# EAGLE board Maker Display2 (EAGLE 7.3.0), part 1 of 2
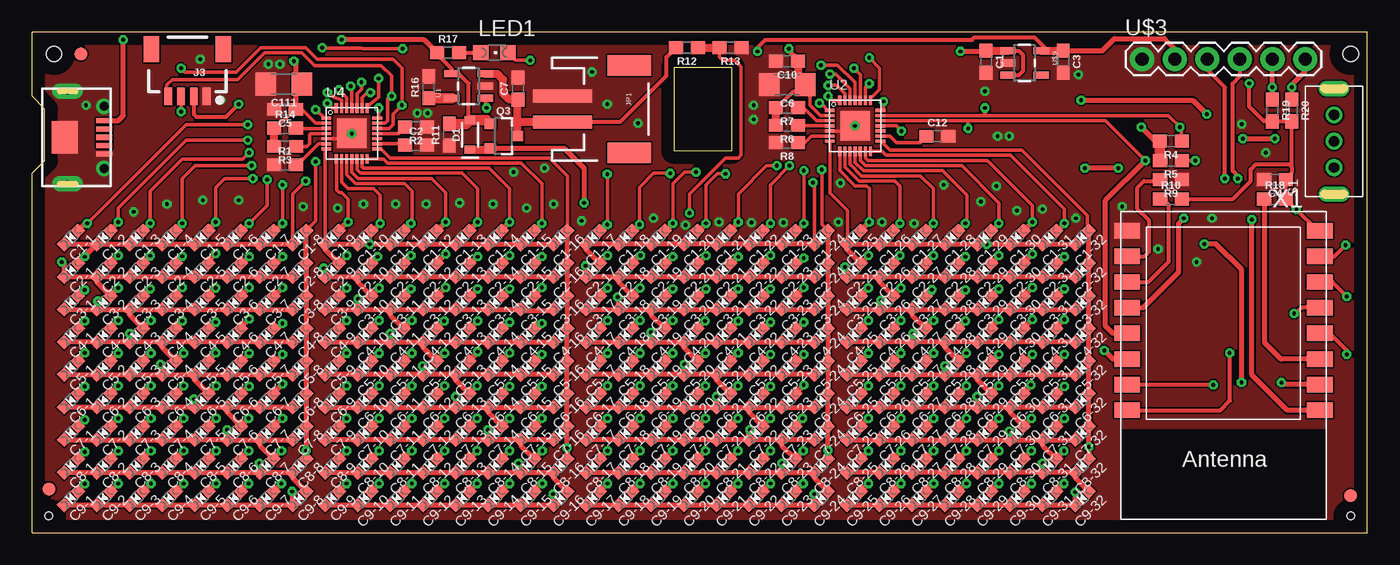
[diagram p5: board, top side]
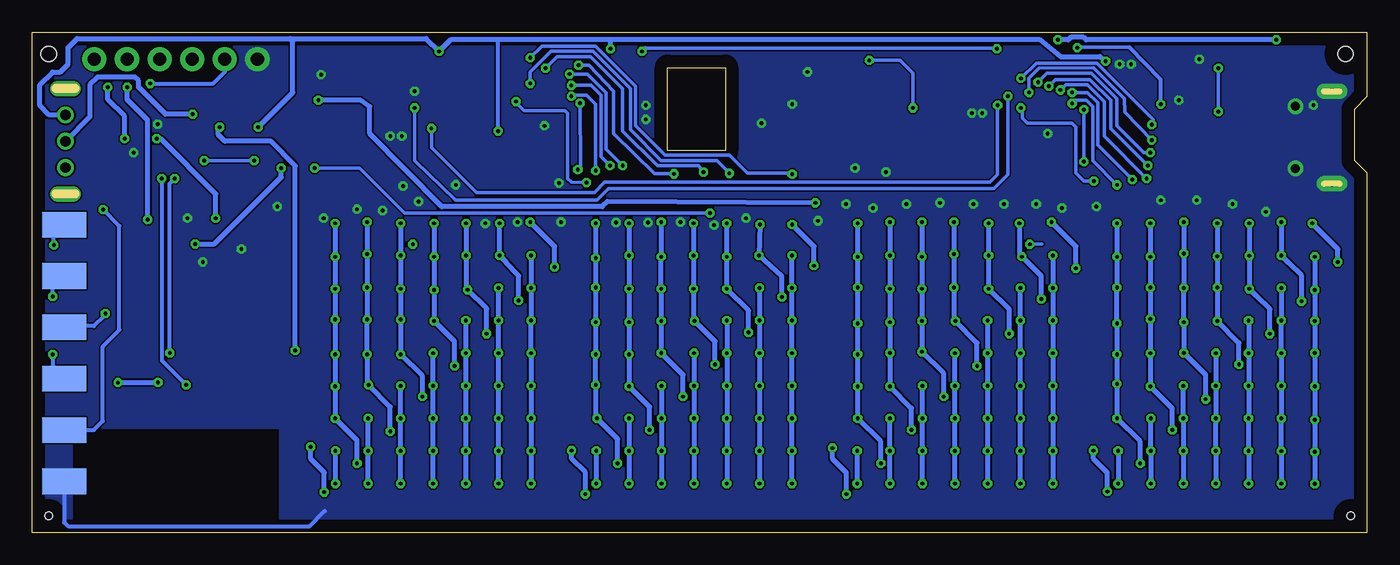
[diagram p6: board, bottom side, seen from below]

Size 104 x 39 mm. Coordinates in mm from the lower left corner, seen from the top.
Outline: 0,0 104,0 104,39 0,39 0,34 1,33 1,29 0,28 0,0
Outline: 50,36.25 50,29.75 54.5,29.75 54.5,36.25 50,36.25
Copper layers (1*16): Top 0.035mm / dielectric 1.5mm / Bottom 0.035mm
Design rules "default *": minimum track width 0.15mm, minimum drill 0.29mm, track to track 5mil, track to pad 5mil, pad to pad 5mil, via to via 5mil, smd to smd 0mil, copper to edge 40mil, drill to drill 8mil, minimum pad ring 10mil, minimum via ring 8mil, stop-mask expansion 4mil, vias tented up to drill 0.5mm, thermal gap 10mil
Holes 0.6 mm at 1.3,1.3 102.7,1.3
Holes 1.2 mm at 1.7,37.3 102.7,37.3

## Footprints (pad centres in the part's own frame; a part is rotated, then mirrored left to right if it is on the bottom)
0603 = smd 1.1 x 1: 1 -0.85,0; 2 0.85,0
CHIPLED_0603_NOOUTLINE = smd 0.8 x 0.8: A 0,-0.75; C 0,0.75
1206 = smd 1.6 x 1.8: 1 -1.4,0; 2 1.4,0
SOD-323 = smd 0.63 x 0.83: A 1.15,0; C -1.15,0
1X04_1MM_RA = smd 0.6 x 1.35: 1 -1.5,0; 2 -0.5,0; 3 0.5,0; 4 1.5,0 | smd 1.2 x 2: NC1 2.8,-3.675; NC2 -2.8,-3.675
JST-2-SMD = smd 1 x 4.6: 1 -1,-3.7; 2 1,-3.7 | smd 1.6 x 3.4: NC1 -3.4,1.5; NC2 3.4,1.5
FIDUCIAL-1X2 = smd 1 x 1: 1 0,0
CHIPLED_0805 = smd 1.2 x 1.2: A 0,-1.05; C 0,1.05
SOT23-3 = smd 0.8 x 0.9: 1 -0.95,-1; 2 0.95,-1; 3 0,1.1
SK-12D02-VG5 = drill 0.8: 1 -2.05,0; 2 0,0; 3 2.05,0 | drill 0.5 pad 1.2 long: P$2 -4.1,0; P$5 4.1,0
SOT23-5 = smd 0.55 x 1.2: 1 -0.95,-1.3; 2 0,-1.3; 3 0.95,-1.3; 4 0.95,1.3; 5 -0.95,1.3
QFN28 = smd 0.75 x 0.25: 1 -1.975,1.2; 2 -1.975,0.8; 3 -1.975,0.4; 4 -1.975,0; 5 -1.975,-0.4; 6 -1.975,-0.8; 7 -1.975,-1.2; 15 1.975,-1.2; 16 1.975,-0.8; 17 1.975,-0.4; 18 1.975,0; 19 1.975,0.4; 20 1.975,0.8; 21 1.975,1.2 | smd 0.25 x 0.75: 8 -1.2,-1.975; 9 -0.8,-1.975; 10 -0.4,-1.975; 11 0,-1.975; 12 0.4,-1.975; 13 0.8,-1.975; 14 1.2,-1.975; 22 1.2,1.975; 23 0.8,1.975; 24 0.4,1.975; 25 0,1.975; 26 -0.4,1.975; 27 -0.8,1.975; 28 -1.2,1.975 | smd 2.3 x 2.3: 29_GND 0,0
ESP-PROGRAMMING-PORT = drill 1.016 pad 1.88: 1 -6.35,0; 2 -3.81,0; 3 -1.27,0; 4 1.27,0; 5 3.81,0; 6 6.35,0
PAD-1 = smd 3.41 x 2: 1 0,0
U-F-M5DD-Y-L = smd 0.4 x 1.25: 1 1.3,0; 2 0.65,0; 3 0,0; 4 -0.655,0; 5 -1.3,0 | smd 2.54 x 2: PAD 0,3.06 | drill 0.7 pad 1.2: SHIELD1 2.425,0; SHIELD2 -2.425,0 | drill 0.5 pad 1.2 long: SHIELD3 -3.6,2.84; SHIELD4 3.6,2.84
ESP-12 = smd 2 x 1.2: 1 -7.5,4.5; 2 -7.5,2.5; 3 -7.5,0.5; 4 -7.5,-1.5; 5 -7.5,-3.5; 6 -7.5,-5.5; 7 -7.5,-7.5; 8 -7.5,-9.5; 9 7.5,-9.5; 10 7.5,-7.5; 11 7.5,-5.5; 12 7.5,-3.5; 13 7.5,-1.5; 14 7.5,0.5; 15 7.5,2.5; 16 7.5,4.5

## Placement (x,y rotation side)
C1  2.2uF  [0603]  74.3,36.7 270 top
C1-1  COLOR  [CHIPLED_0603_NOOUTLINE]  3.03,23 135 top
C1-2  COLOR  [CHIPLED_0603_NOOUTLINE]  5.57,23 135 top
C1-3  COLOR  [CHIPLED_0603_NOOUTLINE]  8.11,23 135 top
C1-4  COLOR  [CHIPLED_0603_NOOUTLINE]  10.65,23 135 top
C1-5  COLOR  [CHIPLED_0603_NOOUTLINE]  13.19,23 135 top
C1-6  COLOR  [CHIPLED_0603_NOOUTLINE]  15.73,23 135 top
C1-7  COLOR  [CHIPLED_0603_NOOUTLINE]  18.27,23 135 top
C1-8  COLOR  [CHIPLED_0603_NOOUTLINE]  20.81,23 135 top
C1-9  COLOR  [CHIPLED_0603_NOOUTLINE]  23.35,23 135 top
C1-10  COLOR  [CHIPLED_0603_NOOUTLINE]  25.89,23 135 top
C1-11  COLOR  [CHIPLED_0603_NOOUTLINE]  28.43,23 135 top
C1-12  COLOR  [CHIPLED_0603_NOOUTLINE]  30.97,23 135 top
C1-13  COLOR  [CHIPLED_0603_NOOUTLINE]  33.51,23 135 top
C1-14  COLOR  [CHIPLED_0603_NOOUTLINE]  36.05,23 135 top
C1-15  COLOR  [CHIPLED_0603_NOOUTLINE]  38.59,23 135 top
C1-16  COLOR  [CHIPLED_0603_NOOUTLINE]  41.13,23 135 top
C1-17  COLOR  [CHIPLED_0603_NOOUTLINE]  43.67,23 135 top
C1-18  COLOR  [CHIPLED_0603_NOOUTLINE]  46.21,23 135 top
C1-19  COLOR  [CHIPLED_0603_NOOUTLINE]  48.75,23 135 top
C1-20  COLOR  [CHIPLED_0603_NOOUTLINE]  51.29,23 135 top
C1-21  COLOR  [CHIPLED_0603_NOOUTLINE]  53.83,23 135 top
C1-22  COLOR  [CHIPLED_0603_NOOUTLINE]  56.37,23 135 top
C1-23  COLOR  [CHIPLED_0603_NOOUTLINE]  58.91,23 135 top
C1-24  COLOR  [CHIPLED_0603_NOOUTLINE]  61.45,23 135 top
C1-25  COLOR  [CHIPLED_0603_NOOUTLINE]  63.99,23 135 top
C1-26  COLOR  [CHIPLED_0603_NOOUTLINE]  66.53,23 135 top
C1-27  COLOR  [CHIPLED_0603_NOOUTLINE]  69.07,23 135 top
C1-28  COLOR  [CHIPLED_0603_NOOUTLINE]  71.61,23 135 top
C1-29  COLOR  [CHIPLED_0603_NOOUTLINE]  74.15,23 135 top
C1-30  COLOR  [CHIPLED_0603_NOOUTLINE]  76.69,23 135 top
C1-31  COLOR  [CHIPLED_0603_NOOUTLINE]  79.23,23 135 top
C1-32  COLOR  [CHIPLED_0603_NOOUTLINE]  81.77,23 135 top
C2  0.1uF  [0603]  29.9,30.2 0 top
C2-1  COLOR  [CHIPLED_0603_NOOUTLINE]  3.03,20.46 135 top
C2-2  COLOR  [CHIPLED_0603_NOOUTLINE]  5.57,20.46 135 top
C2-3  COLOR  [CHIPLED_0603_NOOUTLINE]  8.11,20.46 135 top
C2-4  COLOR  [CHIPLED_0603_NOOUTLINE]  10.65,20.46 135 top
C2-5  COLOR  [CHIPLED_0603_NOOUTLINE]  13.19,20.46 135 top
C2-6  COLOR  [CHIPLED_0603_NOOUTLINE]  15.73,20.46 135 top
C2-7  COLOR  [CHIPLED_0603_NOOUTLINE]  18.27,20.46 135 top
C2-8  COLOR  [CHIPLED_0603_NOOUTLINE]  20.81,20.46 135 top
C2-9  COLOR  [CHIPLED_0603_NOOUTLINE]  23.35,20.46 135 top
C2-10  COLOR  [CHIPLED_0603_NOOUTLINE]  25.89,20.46 135 top
C2-11  COLOR  [CHIPLED_0603_NOOUTLINE]  28.43,20.46 135 top
C2-12  COLOR  [CHIPLED_0603_NOOUTLINE]  30.97,20.46 135 top
C2-13  COLOR  [CHIPLED_0603_NOOUTLINE]  33.51,20.46 135 top
C2-14  COLOR  [CHIPLED_0603_NOOUTLINE]  36.05,20.46 135 top
C2-15  COLOR  [CHIPLED_0603_NOOUTLINE]  38.59,20.46 135 top
C2-16  COLOR  [CHIPLED_0603_NOOUTLINE]  41.13,20.46 135 top
C2-17  COLOR  [CHIPLED_0603_NOOUTLINE]  43.67,20.46 135 top
C2-18  COLOR  [CHIPLED_0603_NOOUTLINE]  46.21,20.46 135 top
C2-19  COLOR  [CHIPLED_0603_NOOUTLINE]  48.75,20.46 135 top
C2-20  COLOR  [CHIPLED_0603_NOOUTLINE]  51.29,20.46 135 top
C2-21  COLOR  [CHIPLED_0603_NOOUTLINE]  53.83,20.46 135 top
C2-22  COLOR  [CHIPLED_0603_NOOUTLINE]  56.37,20.46 135 top
C2-23  COLOR  [CHIPLED_0603_NOOUTLINE]  58.91,20.46 135 top
C2-24  COLOR  [CHIPLED_0603_NOOUTLINE]  61.45,20.46 135 top
C2-25  COLOR  [CHIPLED_0603_NOOUTLINE]  63.99,20.46 135 top
C2-26  COLOR  [CHIPLED_0603_NOOUTLINE]  66.53,20.46 135 top
C2-27  COLOR  [CHIPLED_0603_NOOUTLINE]  69.07,20.46 135 top
C2-28  COLOR  [CHIPLED_0603_NOOUTLINE]  71.61,20.46 135 top
C2-29  COLOR  [CHIPLED_0603_NOOUTLINE]  74.15,20.46 135 top
C2-30  COLOR  [CHIPLED_0603_NOOUTLINE]  76.69,20.46 135 top
C2-31  COLOR  [CHIPLED_0603_NOOUTLINE]  79.23,20.46 135 top
C2-32  COLOR  [CHIPLED_0603_NOOUTLINE]  81.77,20.46 135 top
C3  2.2uF  [0603]  80.3,36.7 270 top
C3-1  COLOR  [CHIPLED_0603_NOOUTLINE]  3.03,17.92 135 top
C3-2  COLOR  [CHIPLED_0603_NOOUTLINE]  5.57,17.92 135 top
C3-3  COLOR  [CHIPLED_0603_NOOUTLINE]  8.11,17.92 135 top
C3-4  COLOR  [CHIPLED_0603_NOOUTLINE]  10.65,17.92 135 top
C3-5  COLOR  [CHIPLED_0603_NOOUTLINE]  13.19,17.92 135 top
C3-6  COLOR  [CHIPLED_0603_NOOUTLINE]  15.73,17.92 135 top
C3-7  COLOR  [CHIPLED_0603_NOOUTLINE]  18.27,17.92 135 top
C3-8  COLOR  [CHIPLED_0603_NOOUTLINE]  20.81,17.92 135 top
C3-9  COLOR  [CHIPLED_0603_NOOUTLINE]  23.35,17.92 135 top
C3-10  COLOR  [CHIPLED_0603_NOOUTLINE]  25.89,17.92 135 top
C3-11  COLOR  [CHIPLED_0603_NOOUTLINE]  28.43,17.92 135 top
C3-12  COLOR  [CHIPLED_0603_NOOUTLINE]  30.97,17.92 135 top
C3-13  COLOR  [CHIPLED_0603_NOOUTLINE]  33.51,17.92 135 top
C3-14  COLOR  [CHIPLED_0603_NOOUTLINE]  36.05,17.92 135 top
C3-15  COLOR  [CHIPLED_0603_NOOUTLINE]  38.59,17.92 135 top
C3-16  COLOR  [CHIPLED_0603_NOOUTLINE]  41.13,17.92 135 top
C3-17  COLOR  [CHIPLED_0603_NOOUTLINE]  43.67,17.92 135 top
C3-18  COLOR  [CHIPLED_0603_NOOUTLINE]  46.21,17.92 135 top
C3-19  COLOR  [CHIPLED_0603_NOOUTLINE]  48.75,17.92 135 top
C3-20  COLOR  [CHIPLED_0603_NOOUTLINE]  51.29,17.92 135 top
C3-21  COLOR  [CHIPLED_0603_NOOUTLINE]  53.83,17.92 135 top
C3-22  COLOR  [CHIPLED_0603_NOOUTLINE]  56.37,17.92 135 top
C3-23  COLOR  [CHIPLED_0603_NOOUTLINE]  58.91,17.92 135 top
C3-24  COLOR  [CHIPLED_0603_NOOUTLINE]  61.45,17.92 135 top
C3-25  COLOR  [CHIPLED_0603_NOOUTLINE]  63.99,17.92 135 top
C3-26  COLOR  [CHIPLED_0603_NOOUTLINE]  66.53,17.92 135 top
C3-27  COLOR  [CHIPLED_0603_NOOUTLINE]  69.07,17.92 135 top
C3-28  COLOR  [CHIPLED_0603_NOOUTLINE]  71.61,17.92 135 top
C3-29  COLOR  [CHIPLED_0603_NOOUTLINE]  74.15,17.92 135 top
C3-30  COLOR  [CHIPLED_0603_NOOUTLINE]  76.69,17.92 135 top
C3-31  COLOR  [CHIPLED_0603_NOOUTLINE]  79.23,17.92 135 top
C3-32  COLOR  [CHIPLED_0603_NOOUTLINE]  81.77,17.92 135 top
C4  0.1uF  [0603]  96.8,27.5 180 top
C4-1  COLOR  [CHIPLED_0603_NOOUTLINE]  3.03,15.38 135 top
C4-2  COLOR  [CHIPLED_0603_NOOUTLINE]  5.57,15.38 135 top
C4-3  COLOR  [CHIPLED_0603_NOOUTLINE]  8.11,15.38 135 top
C4-4  COLOR  [CHIPLED_0603_NOOUTLINE]  10.65,15.38 135 top
C4-5  COLOR  [CHIPLED_0603_NOOUTLINE]  13.19,15.38 135 top
C4-6  COLOR  [CHIPLED_0603_NOOUTLINE]  15.73,15.38 135 top
C4-7  COLOR  [CHIPLED_0603_NOOUTLINE]  18.27,15.38 135 top
C4-8  COLOR  [CHIPLED_0603_NOOUTLINE]  20.81,15.38 135 top
C4-9  COLOR  [CHIPLED_0603_NOOUTLINE]  23.35,15.38 135 top
C4-10  COLOR  [CHIPLED_0603_NOOUTLINE]  25.89,15.38 135 top
C4-11  COLOR  [CHIPLED_0603_NOOUTLINE]  28.43,15.38 135 top
C4-12  COLOR  [CHIPLED_0603_NOOUTLINE]  30.97,15.38 135 top
C4-13  COLOR  [CHIPLED_0603_NOOUTLINE]  33.51,15.38 135 top
C4-14  COLOR  [CHIPLED_0603_NOOUTLINE]  36.05,15.38 135 top
C4-15  COLOR  [CHIPLED_0603_NOOUTLINE]  38.59,15.38 135 top
C4-16  COLOR  [CHIPLED_0603_NOOUTLINE]  41.13,15.38 135 top
C4-17  COLOR  [CHIPLED_0603_NOOUTLINE]  43.67,15.38 135 top
C4-18  COLOR  [CHIPLED_0603_NOOUTLINE]  46.21,15.38 135 top
C4-19  COLOR  [CHIPLED_0603_NOOUTLINE]  48.75,15.38 135 top
C4-20  COLOR  [CHIPLED_0603_NOOUTLINE]  51.29,15.38 135 top
C4-21  COLOR  [CHIPLED_0603_NOOUTLINE]  53.83,15.38 135 top
C4-22  COLOR  [CHIPLED_0603_NOOUTLINE]  56.37,15.38 135 top
C4-23  COLOR  [CHIPLED_0603_NOOUTLINE]  58.91,15.38 135 top
C4-24  COLOR  [CHIPLED_0603_NOOUTLINE]  61.45,15.38 135 top
C4-25  COLOR  [CHIPLED_0603_NOOUTLINE]  63.99,15.38 135 top
C4-26  COLOR  [CHIPLED_0603_NOOUTLINE]  66.53,15.38 135 top
C4-27  COLOR  [CHIPLED_0603_NOOUTLINE]  69.07,15.38 135 top
C4-28  COLOR  [CHIPLED_0603_NOOUTLINE]  71.61,15.38 135 top
C4-29  COLOR  [CHIPLED_0603_NOOUTLINE]  74.15,15.38 135 top
C4-30  COLOR  [CHIPLED_0603_NOOUTLINE]  76.69,15.38 135 top
C4-31  COLOR  [CHIPLED_0603_NOOUTLINE]  79.23,15.38 135 top
C4-32  COLOR  [CHIPLED_0603_NOOUTLINE]  81.77,15.38 135 top
C5  0.1uF  [0603]  19.7,32.98 180 top
C5-1  COLOR  [CHIPLED_0603_NOOUTLINE]  3.03,12.84 135 top
C5-2  COLOR  [CHIPLED_0603_NOOUTLINE]  5.57,12.84 135 top
C5-3  COLOR  [CHIPLED_0603_NOOUTLINE]  8.11,12.84 135 top
C5-4  COLOR  [CHIPLED_0603_NOOUTLINE]  10.65,12.84 135 top
C5-5  COLOR  [CHIPLED_0603_NOOUTLINE]  13.19,12.84 135 top
C5-6  COLOR  [CHIPLED_0603_NOOUTLINE]  15.73,12.84 135 top
C5-7  COLOR  [CHIPLED_0603_NOOUTLINE]  18.27,12.84 135 top
C5-8  COLOR  [CHIPLED_0603_NOOUTLINE]  20.81,12.84 135 top
C5-9  COLOR  [CHIPLED_0603_NOOUTLINE]  23.35,12.84 135 top
C5-10  COLOR  [CHIPLED_0603_NOOUTLINE]  25.89,12.84 135 top
C5-11  COLOR  [CHIPLED_0603_NOOUTLINE]  28.43,12.84 135 top
C5-12  COLOR  [CHIPLED_0603_NOOUTLINE]  30.97,12.84 135 top
C5-13  COLOR  [CHIPLED_0603_NOOUTLINE]  33.51,12.84 135 top
C5-14  COLOR  [CHIPLED_0603_NOOUTLINE]  36.05,12.84 135 top
C5-15  COLOR  [CHIPLED_0603_NOOUTLINE]  38.59,12.84 135 top
C5-16  COLOR  [CHIPLED_0603_NOOUTLINE]  41.13,12.84 135 top
C5-17  COLOR  [CHIPLED_0603_NOOUTLINE]  43.67,12.84 135 top
C5-18  COLOR  [CHIPLED_0603_NOOUTLINE]  46.21,12.84 135 top
C5-19  COLOR  [CHIPLED_0603_NOOUTLINE]  48.75,12.84 135 top
C5-20  COLOR  [CHIPLED_0603_NOOUTLINE]  51.29,12.84 135 top
C5-21  COLOR  [CHIPLED_0603_NOOUTLINE]  53.83,12.84 135 top
C5-22  COLOR  [CHIPLED_0603_NOOUTLINE]  56.37,12.84 135 top
C5-23  COLOR  [CHIPLED_0603_NOOUTLINE]  58.91,12.84 135 top
C5-24  COLOR  [CHIPLED_0603_NOOUTLINE]  61.45,12.84 135 top
C5-25  COLOR  [CHIPLED_0603_NOOUTLINE]  63.99,12.84 135 top
C5-26  COLOR  [CHIPLED_0603_NOOUTLINE]  66.53,12.84 135 top
C5-27  COLOR  [CHIPLED_0603_NOOUTLINE]  69.07,12.84 135 top
C5-28  COLOR  [CHIPLED_0603_NOOUTLINE]  71.61,12.84 135 top
C5-29  COLOR  [CHIPLED_0603_NOOUTLINE]  74.15,12.84 135 top
C5-30  COLOR  [CHIPLED_0603_NOOUTLINE]  76.69,12.84 135 top
C5-31  COLOR  [CHIPLED_0603_NOOUTLINE]  79.23,12.84 135 top
C5-32  COLOR  [CHIPLED_0603_NOOUTLINE]  81.77,12.84 135 top
C6  10uF  [1206]  58.8,34.91 180 top
C6-1  COLOR  [CHIPLED_0603_NOOUTLINE]  3.03,10.3 135 top
C6-2  COLOR  [CHIPLED_0603_NOOUTLINE]  5.57,10.3 135 top
C6-3  COLOR  [CHIPLED_0603_NOOUTLINE]  8.11,10.3 135 top
C6-4  COLOR  [CHIPLED_0603_NOOUTLINE]  10.65,10.3 135 top
C6-5  COLOR  [CHIPLED_0603_NOOUTLINE]  13.19,10.3 135 top
C6-6  COLOR  [CHIPLED_0603_NOOUTLINE]  15.73,10.3 135 top
C6-7  COLOR  [CHIPLED_0603_NOOUTLINE]  18.27,10.3 135 top
C6-8  COLOR  [CHIPLED_0603_NOOUTLINE]  20.81,10.3 135 top
C6-9  COLOR  [CHIPLED_0603_NOOUTLINE]  23.35,10.3 135 top
C6-10  COLOR  [CHIPLED_0603_NOOUTLINE]  25.89,10.3 135 top
C6-11  COLOR  [CHIPLED_0603_NOOUTLINE]  28.43,10.3 135 top
C6-12  COLOR  [CHIPLED_0603_NOOUTLINE]  30.97,10.3 135 top
C6-13  COLOR  [CHIPLED_0603_NOOUTLINE]  33.51,10.3 135 top
C6-14  COLOR  [CHIPLED_0603_NOOUTLINE]  36.05,10.3 135 top
C6-15  COLOR  [CHIPLED_0603_NOOUTLINE]  38.59,10.3 135 top
C6-16  COLOR  [CHIPLED_0603_NOOUTLINE]  41.13,10.3 135 top
C6-17  COLOR  [CHIPLED_0603_NOOUTLINE]  43.67,10.3 135 top
C6-18  COLOR  [CHIPLED_0603_NOOUTLINE]  46.21,10.3 135 top
C6-19  COLOR  [CHIPLED_0603_NOOUTLINE]  48.75,10.3 135 top
C6-20  COLOR  [CHIPLED_0603_NOOUTLINE]  51.29,10.3 135 top
C6-21  COLOR  [CHIPLED_0603_NOOUTLINE]  53.83,10.3 135 top
C6-22  COLOR  [CHIPLED_0603_NOOUTLINE]  56.37,10.3 135 top
C6-23  COLOR  [CHIPLED_0603_NOOUTLINE]  58.91,10.3 135 top
C6-24  COLOR  [CHIPLED_0603_NOOUTLINE]  61.45,10.3 135 top
C6-25  COLOR  [CHIPLED_0603_NOOUTLINE]  63.99,10.3 135 top
C6-26  COLOR  [CHIPLED_0603_NOOUTLINE]  66.53,10.3 135 top
C6-27  COLOR  [CHIPLED_0603_NOOUTLINE]  69.07,10.3 135 top
C6-28  COLOR  [CHIPLED_0603_NOOUTLINE]  71.61,10.3 135 top
C6-29  COLOR  [CHIPLED_0603_NOOUTLINE]  74.15,10.3 135 top
C6-30  COLOR  [CHIPLED_0603_NOOUTLINE]  76.69,10.3 135 top
C6-31  COLOR  [CHIPLED_0603_NOOUTLINE]  79.23,10.3 135 top
C6-32  COLOR  [CHIPLED_0603_NOOUTLINE]  81.77,10.3 135 top
C7  2.2uF  [0603]  37.85,34.6 90 top
C7-1  COLOR  [CHIPLED_0603_NOOUTLINE]  3.03,7.76 135 top
C7-2  COLOR  [CHIPLED_0603_NOOUTLINE]  5.57,7.76 135 top
C7-3  COLOR  [CHIPLED_0603_NOOUTLINE]  8.11,7.76 135 top
C7-4  COLOR  [CHIPLED_0603_NOOUTLINE]  10.65,7.76 135 top
C7-5  COLOR  [CHIPLED_0603_NOOUTLINE]  13.19,7.76 135 top
C7-6  COLOR  [CHIPLED_0603_NOOUTLINE]  15.73,7.76 135 top
C7-7  COLOR  [CHIPLED_0603_NOOUTLINE]  18.27,7.76 135 top
C7-8  COLOR  [CHIPLED_0603_NOOUTLINE]  20.81,7.76 135 top
C7-9  COLOR  [CHIPLED_0603_NOOUTLINE]  23.35,7.76 135 top
C7-10  COLOR  [CHIPLED_0603_NOOUTLINE]  25.89,7.76 135 top
C7-11  COLOR  [CHIPLED_0603_NOOUTLINE]  28.43,7.76 135 top
C7-12  COLOR  [CHIPLED_0603_NOOUTLINE]  30.97,7.76 135 top
C7-13  COLOR  [CHIPLED_0603_NOOUTLINE]  33.51,7.76 135 top
C7-14  COLOR  [CHIPLED_0603_NOOUTLINE]  36.05,7.76 135 top
C7-15  COLOR  [CHIPLED_0603_NOOUTLINE]  38.59,7.76 135 top
C7-16  COLOR  [CHIPLED_0603_NOOUTLINE]  41.13,7.76 135 top
C7-17  COLOR  [CHIPLED_0603_NOOUTLINE]  43.67,7.76 135 top
C7-18  COLOR  [CHIPLED_0603_NOOUTLINE]  46.21,7.76 135 top
C7-19  COLOR  [CHIPLED_0603_NOOUTLINE]  48.75,7.76 135 top
C7-20  COLOR  [CHIPLED_0603_NOOUTLINE]  51.29,7.76 135 top
C7-21  COLOR  [CHIPLED_0603_NOOUTLINE]  53.83,7.76 135 top
C7-22  COLOR  [CHIPLED_0603_NOOUTLINE]  56.37,7.76 135 top
C7-23  COLOR  [CHIPLED_0603_NOOUTLINE]  58.91,7.76 135 top
C7-24  COLOR  [CHIPLED_0603_NOOUTLINE]  61.45,7.76 135 top
C7-25  COLOR  [CHIPLED_0603_NOOUTLINE]  63.99,7.76 135 top
C7-26  COLOR  [CHIPLED_0603_NOOUTLINE]  66.53,7.76 135 top
C7-27  COLOR  [CHIPLED_0603_NOOUTLINE]  69.07,7.76 135 top
C7-28  COLOR  [CHIPLED_0603_NOOUTLINE]  71.61,7.76 135 top
C7-29  COLOR  [CHIPLED_0603_NOOUTLINE]  74.15,7.76 135 top
C7-30  COLOR  [CHIPLED_0603_NOOUTLINE]  76.69,7.76 135 top
C7-31  COLOR  [CHIPLED_0603_NOOUTLINE]  79.23,7.76 135 top
C7-32  COLOR  [CHIPLED_0603_NOOUTLINE]  81.77,7.76 135 top
C8-1  COLOR  [CHIPLED_0603_NOOUTLINE]  3.03,5.22 135 top
C8-2  COLOR  [CHIPLED_0603_NOOUTLINE]  5.57,5.22 135 top
C8-3  COLOR  [CHIPLED_0603_NOOUTLINE]  8.11,5.22 135 top
C8-4  COLOR  [CHIPLED_0603_NOOUTLINE]  10.65,5.22 135 top
C8-5  COLOR  [CHIPLED_0603_NOOUTLINE]  13.19,5.22 135 top
C8-6  COLOR  [CHIPLED_0603_NOOUTLINE]  15.73,5.22 135 top
C8-7  COLOR  [CHIPLED_0603_NOOUTLINE]  18.27,5.22 135 top
C8-8  COLOR  [CHIPLED_0603_NOOUTLINE]  20.81,5.22 135 top
C8-9  COLOR  [CHIPLED_0603_NOOUTLINE]  23.35,5.22 135 top
C8-10  COLOR  [CHIPLED_0603_NOOUTLINE]  25.89,5.22 135 top
C8-11  COLOR  [CHIPLED_0603_NOOUTLINE]  28.43,5.22 135 top
C8-12  COLOR  [CHIPLED_0603_NOOUTLINE]  30.97,5.22 135 top
C8-13  COLOR  [CHIPLED_0603_NOOUTLINE]  33.51,5.22 135 top
C8-14  COLOR  [CHIPLED_0603_NOOUTLINE]  36.05,5.22 135 top
C8-15  COLOR  [CHIPLED_0603_NOOUTLINE]  38.59,5.22 135 top
C8-16  COLOR  [CHIPLED_0603_NOOUTLINE]  41.13,5.22 135 top
C8-17  COLOR  [CHIPLED_0603_NOOUTLINE]  43.67,5.22 135 top
C8-18  COLOR  [CHIPLED_0603_NOOUTLINE]  46.21,5.22 135 top
C8-19  COLOR  [CHIPLED_0603_NOOUTLINE]  48.75,5.22 135 top
C8-20  COLOR  [CHIPLED_0603_NOOUTLINE]  51.29,5.22 135 top
C8-21  COLOR  [CHIPLED_0603_NOOUTLINE]  53.83,5.22 135 top
C8-22  COLOR  [CHIPLED_0603_NOOUTLINE]  56.37,5.22 135 top
C8-23  COLOR  [CHIPLED_0603_NOOUTLINE]  58.91,5.22 135 top
C8-24  COLOR  [CHIPLED_0603_NOOUTLINE]  61.45,5.22 135 top
C8-25  COLOR  [CHIPLED_0603_NOOUTLINE]  63.99,5.22 135 top
C8-26  COLOR  [CHIPLED_0603_NOOUTLINE]  66.53,5.22 135 top
C8-27  COLOR  [CHIPLED_0603_NOOUTLINE]  69.07,5.22 135 top
C8-28  COLOR  [CHIPLED_0603_NOOUTLINE]  71.61,5.22 135 top
C8-29  COLOR  [CHIPLED_0603_NOOUTLINE]  74.15,5.22 135 top
C8-30  COLOR  [CHIPLED_0603_NOOUTLINE]  76.69,5.22 135 top
C8-31  COLOR  [CHIPLED_0603_NOOUTLINE]  79.23,5.22 135 top
C8-32  COLOR  [CHIPLED_0603_NOOUTLINE]  81.77,5.22 135 top
C9-1  COLOR  [CHIPLED_0603_NOOUTLINE]  3.03,2.68 135 top
C9-2  COLOR  [CHIPLED_0603_NOOUTLINE]  5.57,2.68 135 top
C9-3  COLOR  [CHIPLED_0603_NOOUTLINE]  8.11,2.68 135 top
C9-4  COLOR  [CHIPLED_0603_NOOUTLINE]  10.65,2.68 135 top
C9-5  COLOR  [CHIPLED_0603_NOOUTLINE]  13.19,2.68 135 top
C9-6  COLOR  [CHIPLED_0603_NOOUTLINE]  15.73,2.68 135 top
C9-7  COLOR  [CHIPLED_0603_NOOUTLINE]  18.27,2.68 135 top
C9-8  COLOR  [CHIPLED_0603_NOOUTLINE]  20.81,2.68 135 top
C9-9  COLOR  [CHIPLED_0603_NOOUTLINE]  23.35,2.68 135 top
C9-10  COLOR  [CHIPLED_0603_NOOUTLINE]  25.89,2.68 135 top
C9-11  COLOR  [CHIPLED_0603_NOOUTLINE]  28.43,2.68 135 top
C9-12  COLOR  [CHIPLED_0603_NOOUTLINE]  30.97,2.68 135 top
C9-13  COLOR  [CHIPLED_0603_NOOUTLINE]  33.51,2.68 135 top
C9-14  COLOR  [CHIPLED_0603_NOOUTLINE]  36.05,2.68 135 top
C9-15  COLOR  [CHIPLED_0603_NOOUTLINE]  38.59,2.68 135 top
C9-16  COLOR  [CHIPLED_0603_NOOUTLINE]  41.13,2.68 135 top
C9-17  COLOR  [CHIPLED_0603_NOOUTLINE]  43.67,2.68 135 top
C9-18  COLOR  [CHIPLED_0603_NOOUTLINE]  46.21,2.68 135 top
C9-19  COLOR  [CHIPLED_0603_NOOUTLINE]  48.75,2.68 135 top
C9-20  COLOR  [CHIPLED_0603_NOOUTLINE]  51.29,2.68 135 top
C9-21  COLOR  [CHIPLED_0603_NOOUTLINE]  53.83,2.68 135 top
C9-22  COLOR  [CHIPLED_0603_NOOUTLINE]  56.37,2.68 135 top
C9-23  COLOR  [CHIPLED_0603_NOOUTLINE]  58.91,2.68 135 top
C9-24  COLOR  [CHIPLED_0603_NOOUTLINE]  61.45,2.68 135 top
C9-25  COLOR  [CHIPLED_0603_NOOUTLINE]  63.99,2.68 135 top
C9-26  COLOR  [CHIPLED_0603_NOOUTLINE]  66.53,2.68 135 top
C9-27  COLOR  [CHIPLED_0603_NOOUTLINE]  69.07,2.68 135 top
C9-28  COLOR  [CHIPLED_0603_NOOUTLINE]  71.61,2.68 135 top
C9-29  COLOR  [CHIPLED_0603_NOOUTLINE]  74.15,2.68 135 top
C9-30  COLOR  [CHIPLED_0603_NOOUTLINE]  76.69,2.68 135 top
C9-31  COLOR  [CHIPLED_0603_NOOUTLINE]  79.23,2.68 135 top
C9-32  COLOR  [CHIPLED_0603_NOOUTLINE]  81.77,2.68 135 top
C10  0.1uF  [0603]  58.8,36.73 180 top
C12  0.1uF  [0603]  70.5,30.88 0 top
C111  10uF  [1206]  19.6,34.95 180 top
D1  BAT20J  [SOD-323]  34.1,31 90 top
J3  [1X04_1MM_RA]  12.1,34 180 top
JP1  [JST-2-SMD]  45,33 270 top
JP2  FIDUCIAL1X2  [FIDUCIAL-1X2]  102.7,2.9 0 top
JP3  FIDUCIAL1X2  [FIDUCIAL-1X2]  1.3,3.4 0 top
JP4  FIDUCIAL1X2  [FIDUCIAL-1X2]  3.8,37.3 0 top
LED1  [CHIPLED_0805]  36,37.4 270 top
Q3  PMOS  [SOT23-3]  36.7,30.9 270 top
R1  20k  [0603]  19.7,28.66 0 top
R2  20k  [0603]  29.9,31.61 180 top
R3  20k  [0603]  19.7,30.1 180 top
R4  4.7k  [0603]  88.69,30.5 180 top
R5  4.7k  [0603]  88.7,29 180 top
R6  20k  [0603]  58.8,31.74 180 top
R7  20k  [0603]  58.8,33.11 180 top
R8  20k  [0603]  58.8,30.39 180 top
R9  10k  [0603]  88.7,27.5 180 top
R10  10k  [0603]  88.7,26 0 top
R11  20k  [0603]  32.5,31 90 top
R12  10k  [0603]  51,37.8 180 top
R13  2.49k  [0603]  54.4,37.8 180 top
R14  20k  [0603]  19.7,31.52 0 top
R16  2.49k  [0603]  30.9,34.7 90 top
R17  1k  [0603]  32.4,37.4 0 top
R18  10k  [0603]  96.8,26 0 top
R19  10k  [0603]  96.6,32.9 270 top
R20  10k  [0603]  98.1,32.9 270 top
S1  SWITCH_SK-12D02-VG5  [SK-12D02-VG5]  101.4,30.5 90 top
U1  MCP73831  [SOT23-5]  34,34.8 90 top
U2  IS31FL3731  [QFN28]  64.1,31.7 0 top
U4  IS31FL3731  [QFN28]  24.9,31.1 0 top
U$3  ESP-PROGRAMMINGPORT  [ESP-PROGRAMMING-PORT]  92.8,36.9 0 top
U$4  PAD-1  [PAD-1]  101.5,12 0 bottom
U$5  PAD-1  [PAD-1]  101.5,16 0 bottom
U$6  PAD-1  [PAD-1]  101.5,20 0 bottom
U$7  PAD-1  [PAD-1]  101.5,24 0 bottom
U$9  SE5218  [SOT23-5]  77.3,36.6 270 top
U$12  PAD-1  [PAD-1]  101.5,8 0 bottom
U$14  PAD-1  [PAD-1]  101.5,4 0 bottom
U$15  USB-MICRO  [U-F-M5DD-Y-L]  5.6,30.8 90 top
U$16  [MAKER-DISPLAY-LOGO-SMALL]  3,8 0 top
U$17  [LOGO-6MM]  75.5,28.4 0 top
U$18  [E-R.IO-6MM]  75.55,26.1 0 top
U$19  [OSH-3MM]  82.3,30.1 0 top
U$20  [EASYC]  9.2,30.35 0 top
U$21  [E-R.IO-BACK-12MM]  2,2 0 top
U$23  [LOGO-BACK-12MM]  37,26 0 top
X1  ESP8266-12  [ESP-12]  92.79,14.03 180 top